# Altium schematic sheet 电机控制.SchDoc: 阿波罗工业控制器四电机六进六出控制器电路
size A4; Revision: V1.4; SheetNumber: 0; SheetTotal: 0
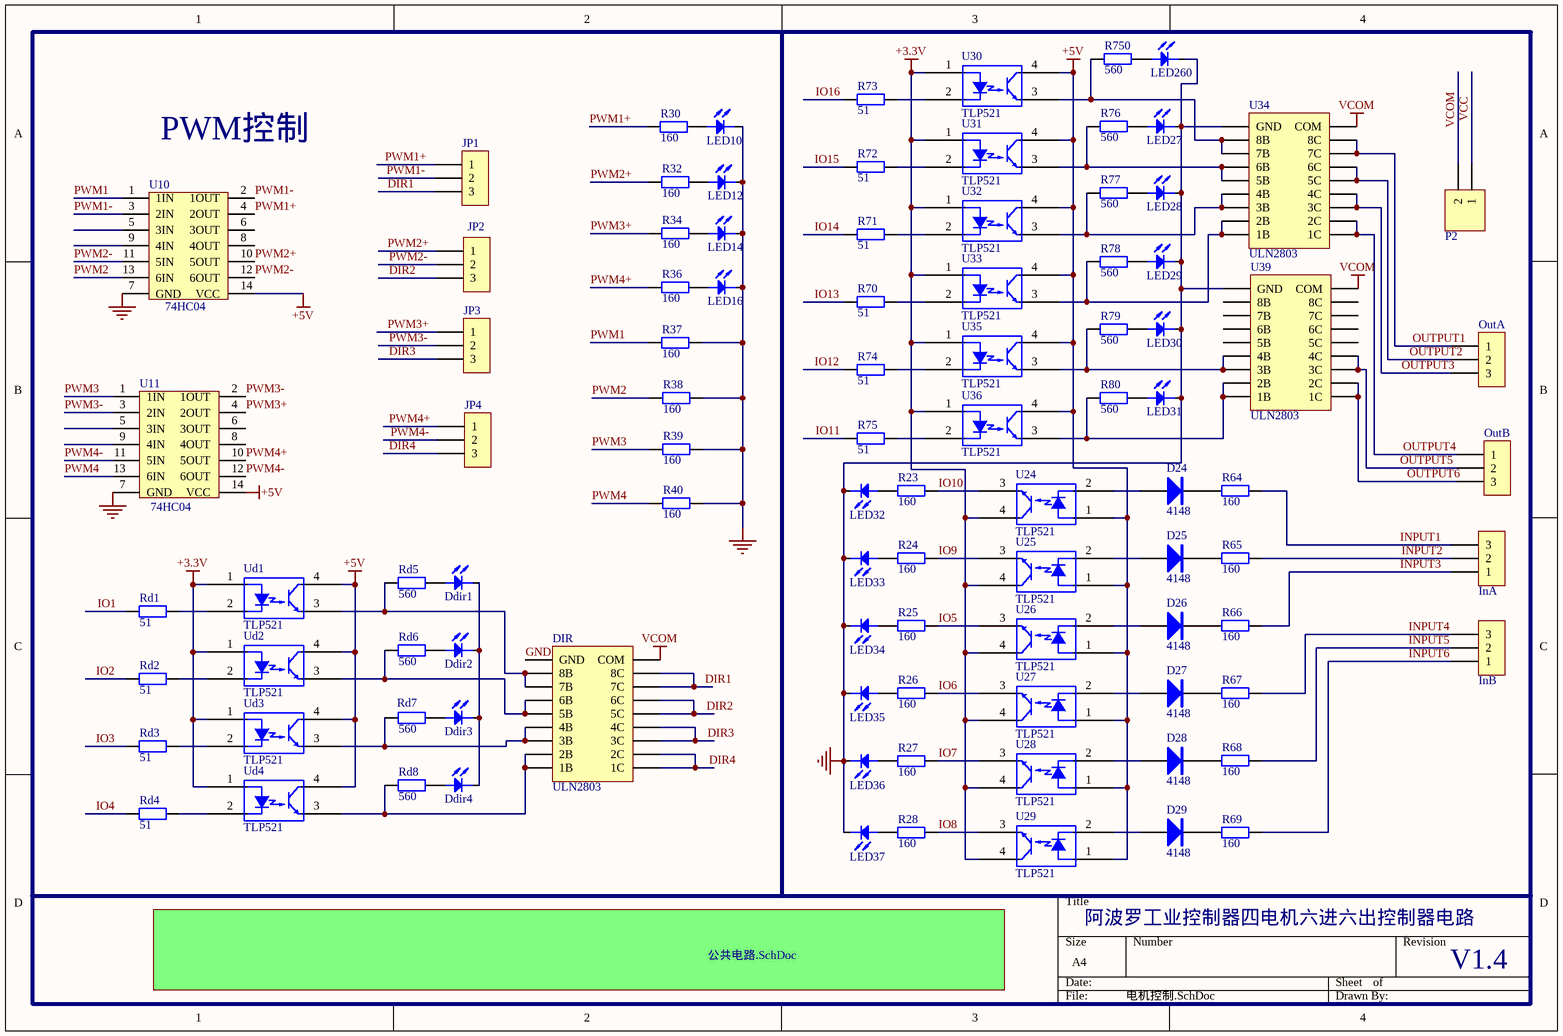
[diagram p0: 电机控制.SchDoc]

## Parts
D24  4148
D25  4148
D26  4148
D27  4148
D28  4148
D29  4148
Ddir1  LED  [SMDLED]  (value not drawn)
Ddir2  LED  [SMDLED]  (value not drawn)
Ddir3  LED  [SMDLED]  (value not drawn)
Ddir4  LED  [SMDLED]  (value not drawn)
DIR  ULN2803  [sol18]
InA  CON3  (value not drawn)
InB  CON3  (value not drawn)
JP1  CON3  (value not drawn)
JP2  CON3  (value not drawn)
JP3  CON3  (value not drawn)
JP4  CON3  (value not drawn)
LED10  LED  [SMDLED]  (value not drawn)
LED12  LED  [SMDLED]  (value not drawn)
LED14  LED  [SMDLED]  (value not drawn)
LED16  LED  [SMDLED]  (value not drawn)
LED27  LED  [SMDLED]  (value not drawn)
LED28  LED  [SMDLED]  (value not drawn)
LED29  LED  [SMDLED]  (value not drawn)
LED30  LED  [SMDLED]  (value not drawn)
LED31  LED  [SMDLED]  (value not drawn)
LED32  LED  [SMDLED]  (value not drawn)
LED33  LED  [SMDLED]  (value not drawn)
LED34  LED  [SMDLED]  (value not drawn)
LED35  LED  [SMDLED]  (value not drawn)
LED36  LED  [SMDLED]  (value not drawn)
LED37  LED  [SMDLED]  (value not drawn)
LED260  LED  [SMDLED]  (value not drawn)
OutA  CON3  (value not drawn)
OutB  CON3  (value not drawn)
P2  (no value)  [HDR1X2]
R23  160  [0603A]
R24  160  [0603A]
R25  160  [0603A]
R26  160  [0603A]
R27  160  [0603A]
R28  160  [0603A]
R30  160  [0603A]
R32  160  [0603A]
R34  160  [0603A]
R36  160  [0603A]
R37  160  [0603A]
R38  160  [0603A]
R39  160  [0603A]
R40  160  [0603A]
R64  160  [0603A]
R65  160  [0603A]
R66  160  [0603A]
R67  160  [0603A]
R68  160  [0603A]
R69  160  [0603A]
R70  51  [0603A]
R71  51  [0603A]
R72  51  [0603A]
R73  51  [0603A]
R74  51  [0603A]
R75  51  [0603A]
R76  560  [0603A]
R77  560  [0603A]
R78  560  [0603A]
R79  560  [0603A]
R80  560  [0603A]
R750  560  [0603A]
Rd1  51  [0603A]
Rd2  51  [0603A]
Rd3  51  [0603A]
Rd4  51  [0603A]
Rd5  560  [0603A]
Rd6  560  [0603A]
Rd7  560  [0603A]
Rd8  560  [0603A]
U10  74HC04  [so-14]
U11  74HC04  [so-14]
U24  TLP521  [PC817]
U25  TLP521  [PC817]
U26  TLP521  [PC817]
U27  TLP521  [PC817]
U28  TLP521  [PC817]
U29  TLP521  [PC817]
U30  TLP521  [PC817]
U31  TLP521  [PC817]
U32  TLP521  [PC817]
U33  TLP521  [PC817]
U34  ULN2803  [sol18]
U35  TLP521  [PC817]
U36  TLP521  [PC817]
U39  ULN2803  [sol18]
Ud1  TLP521  [PC817]
Ud2  TLP521  [PC817]
Ud3  TLP521  [PC817]
Ud4  TLP521  [PC817]

## Sub-sheets
? = 公共电路.SchDoc: no entries

## Nets
+3.3V: U24.4(COL) U25.4(COL) U26.4(COL) U27.4(COL) U28.4(COL) U29.4(COL) U30.1(ANODE) U31.1(ANODE) U32.1(ANODE) U33.1(ANODE) U35.1(ANODE) U36.1(ANODE) Ud1.1(ANODE) Ud2.1(ANODE) Ud3.1(ANODE) Ud4.1(ANODE)
+5V: U10.14(VCC) U11.14(VCC) U24.1(ANODE) U25.1(ANODE) U26.1(ANODE) U27.1(ANODE) U28.1(ANODE) U29.1(ANODE) U30.4(COL) U31.4(COL) U32.4(COL) U33.4(COL) U35.4(COL) U36.4(COL) Ud1.4(COL) Ud2.4(COL) Ud3.4(COL) Ud4.4(COL)
GND: DIR.9(GND) LED10.K LED12.K LED14.K LED16.K LED27.K LED28.K LED29.K LED30.K LED31.K LED32.K LED33.K LED34.K LED35.K LED36.K LED37.K LED260.K R37.2 R38.2 R39.2 R40.2 U10.7(GND) U11.7(GND) U34.9(GND) U39.9(GND)
VCOM: DIR.10(COM) P2.2 U34.10(COM) U39.10(COM)
DIR1: DIR.11(8C) DIR.12(7C) JP1.3
DIR2: DIR.13(6C) DIR.14(5C) JP2.3
DIR3: DIR.15(4C) DIR.16(3C) JP3.3
DIR4: DIR.17(2C) DIR.18(1C) JP4.3
INPUT1: InA.3 R64.2
INPUT2: InA.2 R65.2
INPUT3: InA.1 R66.2
INPUT4: InB.3 R67.2
INPUT5: InB.2 R68.2
INPUT6: InB.1 R69.2
IO1: Rd1.1
IO2: Rd2.1
IO3: Rd3.1
IO4: Rd4.1
IO5: R25.1 U26.3(EMIT)
IO6: R26.1 U27.3(EMIT)
IO7: R27.1 U28.3(EMIT)
IO8: R28.1 U29.3(EMIT)
IO9: R24.1 U25.3(EMIT)
IO10: R23.1 U24.3(EMIT)
IO11: R75.1
IO12: R74.1
IO13: R70.1
IO14: R71.1
IO15: R72.1
IO16: R73.1
OUTPUT1: OutA.1 U34.11(8C) U34.12(7C)
OUTPUT2: OutA.2 U34.13(6C) U34.14(5C)
OUTPUT3: OutA.3 U34.15(4C) U34.16(3C)
OUTPUT4: OutB.1 U34.17(2C) U34.18(1C)
OUTPUT5: OutB.2 U39.15(4C) U39.16(3C)
OUTPUT6: OutB.3 U39.17(2C) U39.18(1C)
PWM1: R37.1 U10.1(1IN)
PWM1+: JP1.1 R30.1 U10.4(2OUT)
PWM1-: JP1.2 U10.2(1OUT) U10.3(2IN)
PWM2: R38.1 U10.13(6IN)
PWM2+: JP2.1 R32.1 U10.10(5OUT)
PWM2-: JP2.2 U10.11(5IN) U10.12(6OUT)
PWM3: R39.1 U11.1(1IN)
PWM3+: JP3.1 R34.1 U11.4(2OUT)
PWM3-: JP3.2 U11.2(1OUT) U11.3(2IN)
PWM4: R40.1 U11.13(6IN)
PWM4+: JP4.1 R36.1 U11.10(5OUT)
PWM4-: JP4.2 U11.11(5IN) U11.12(6OUT)
VCC: P2.1
NetD24_A: D24.A U24.2(CATH)
NetD24_K: D24.K R64.1
NetD25_A: D25.A U25.2(CATH)
NetD25_K: D25.K R65.1
NetD26_A: D26.A U26.2(CATH)
NetD26_K: D26.K R66.1
NetD27_A: D27.A U27.2(CATH)
NetD27_K: D27.K R67.1
NetD28_A: D28.A U28.2(CATH)
NetD28_K: D28.K R68.1
NetD29_A: D29.A U29.2(CATH)
NetD29_K: D29.K R69.1
NetDdir1_A: Ddir1.A Rd5.2
NetDdir1_K: Ddir1.K Ddir2.K Ddir3.K Ddir4.K
NetDdir2_A: Ddir2.A Rd6.2
NetDdir3_A: Ddir3.A Rd7.2
NetDdir4_A: Ddir4.A Rd8.2
NetDIR_1: DIR.1(1B) DIR.2(2B) Rd8.1 Ud4.3(EMIT)
NetDIR_3: DIR.3(3B) DIR.4(4B) Rd7.1 Ud3.3(EMIT)
NetDIR_5: DIR.5(5B) DIR.6(6B) Rd6.1 Ud2.3(EMIT)
NetDIR_7: DIR.7(7B) DIR.8(8B) Rd5.1 Ud1.3(EMIT)
NetLED10_A: LED10.A R30.2
NetLED12_A: LED12.A R32.2
NetLED14_A: LED14.A R34.2
NetLED16_A: LED16.A R36.2
NetLED27_A: LED27.A R76.2
NetLED28_A: LED28.A R77.2
NetLED29_A: LED29.A R78.2
NetLED30_A: LED30.A R79.2
NetLED31_A: LED31.A R80.2
NetLED32_A: LED32.A R23.2
NetLED33_A: LED33.A R24.2
NetLED34_A: LED34.A R25.2
NetLED35_A: LED35.A R26.2
NetLED36_A: LED36.A R27.2
NetLED37_A: LED37.A R28.2
NetLED260_A: LED260.A R750.2
NetR70_2: R70.2 U33.2(CATH)
NetR71_2: R71.2 U32.2(CATH)
NetR72_2: R72.2 U31.2(CATH)
NetR73_2: R73.2 U30.2(CATH)
NetR74_2: R74.2 U35.2(CATH)
NetR75_2: R75.2 U36.2(CATH)
NetR76_1: R76.1 U31.3(EMIT) U34.5(5B) U34.6(6B)
NetR77_1: R77.1 U32.3(EMIT) U34.3(3B) U34.4(4B)
NetR78_1: R78.1 U33.3(EMIT) U34.1(1B) U34.2(2B)
NetR79_1: R79.1 U35.3(EMIT) U39.3(3B) U39.4(4B)
NetR80_1: R80.1 U36.3(EMIT) U39.1(1B) U39.2(2B)
NetR750_1: R750.1 U30.3(EMIT) U34.7(7B) U34.8(8B)
NetRd1_2: Rd1.2 Ud1.2(CATH)
NetRd2_2: Rd2.2 Ud2.2(CATH)
NetRd3_2: Rd3.2 Ud3.2(CATH)
NetRd4_2: Rd4.2 Ud4.2(CATH)

Not connected (* = marked no-connect by the designer): U10 5(3IN) 6(3OUT) 8(4OUT) 9(4IN); U11 5(3IN) 6(3OUT) 8(4OUT) 9(4IN); U39 5(5B) 6(6B) 7(7B) 8(8B) 11(8C) 12(7C) 13(6C) 14(5C)

## Notes on the sheet
- (near U10) PWM控制

## Library data of the parts
P2 = Header 2: Header, 2-Pin; LatestRevisionDate: 17-Jul-2002; LatestRevisionNote: Re-released for DXP Platform.; Publisher: Altium Limited
R23-R28 R30 R32 R34 R36-R40 R64-R80 R750 Rd1-Rd8 = Res2: Resistor; Value: 1K; Published: 8-Jun-2000; LatestRevisionDate: 17-Jul-2002; LatestRevisionNote: Re-released for DXP Platform.; PackageReference: AXIAL-0.4; Publisher: Altium Limited
U24-U33 U35 U36 Ud1-Ud4 = TLP521-1: Single NPN PhotoTransistor OptoCoupler.